# EAGLE design teste3 (EAGLE 9.6.2)
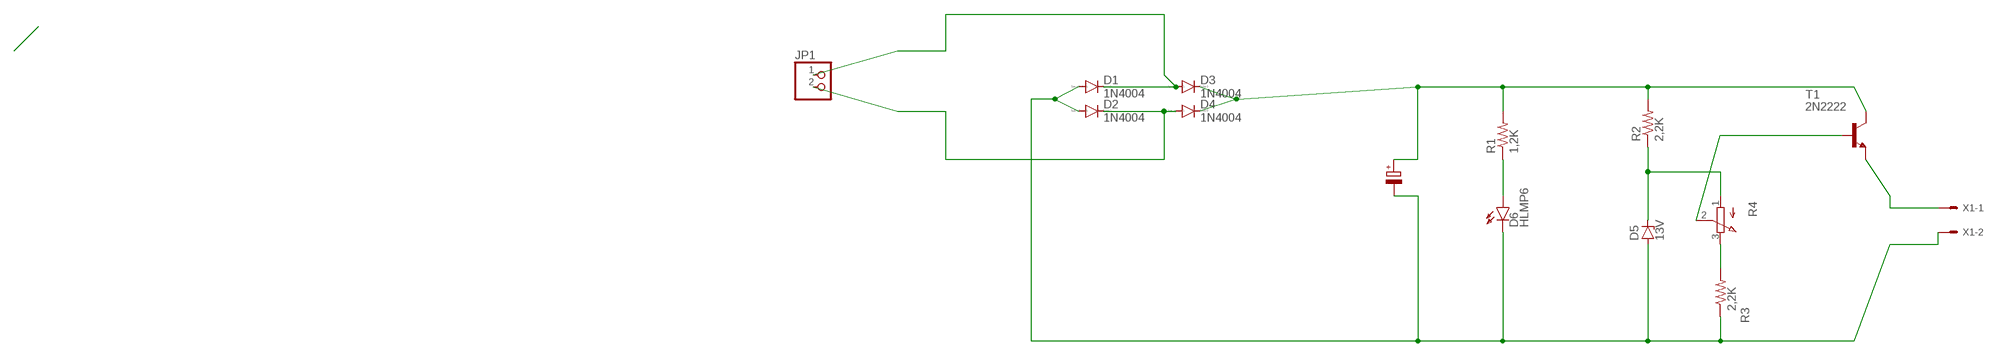
[diagram p0: schematic, sheet 1]

## Parts
D1  1N4004  [DO41-10]
D2  1N4004  [DO41-10]
D3  1N4004  [DO41-10]
D4  1N4004  [DO41-10]
D5  13V  BZD23  [SOD81]
D6  HLMP6  [HLMP6]
JP1  PINHD-1X2  [1X02]
R1  1,2K  R-US_0613/15  [P0613/15]
R2  2,2K  R-US_0613/15  [P0613/15]
R3  2,2K  R-US_0613/15  [P0613/15]
R4  3RP/1610N  [3RP/1610N]
T1  2N2222  [TO18]
X1  KK-156-2  [KK-156-2]

## Nets
N$2: D6.A R1.1
N$3: D1.A D2.A D5.A D6.K R3.1 X1.2
N$4: D2.C D4.A JP1.2
N$5: D3.C D4.C R1.2 R2.2 T1.3(C)
N$6: D5.C R2.1 R4.1(A)
N$7: R3.2 R4.3(E)
N$8: R4.2(S) T1.2(B)
N$9: T1.1(E) X1.1
N$11: D1.C D3.A JP1.1

## Library data of the parts
D1-D4 = diode:1N4004: DIODE general purpose rectifier, 1 A
D5 = diode:BZD23: Z DIODE
D6 = display-hp:HLMP6: LED 2mm horizontal; MF: AGILENT TECHNOLOGIES; MPN: HLMP-6500; OC_FARNELL: 1652490; OC_NEWARK: 40K0088
JP1 = pinhead:PINHD-1X2: PIN HEADER
R1-R3 = rcl:R-US_: RESISTOR, American symbol; SPICEPREFIX: R
R4 = pot:3RP/1610N: 16mm Potentiometer one level Source: http://www.alphapotentiometers.net/html/16mm_pot_2.html
T1 = transistor:2N2222: NPN TRANSISTOR
X1 = con-molex:KK-156-2: KK 156 HEADER Source: http://www.molex.com/pdm_docs/sd/026604100_sd.pdf; MF: MOLEX; OC_FARNELL: unknown; OC_NEWARK: unknown

## Board
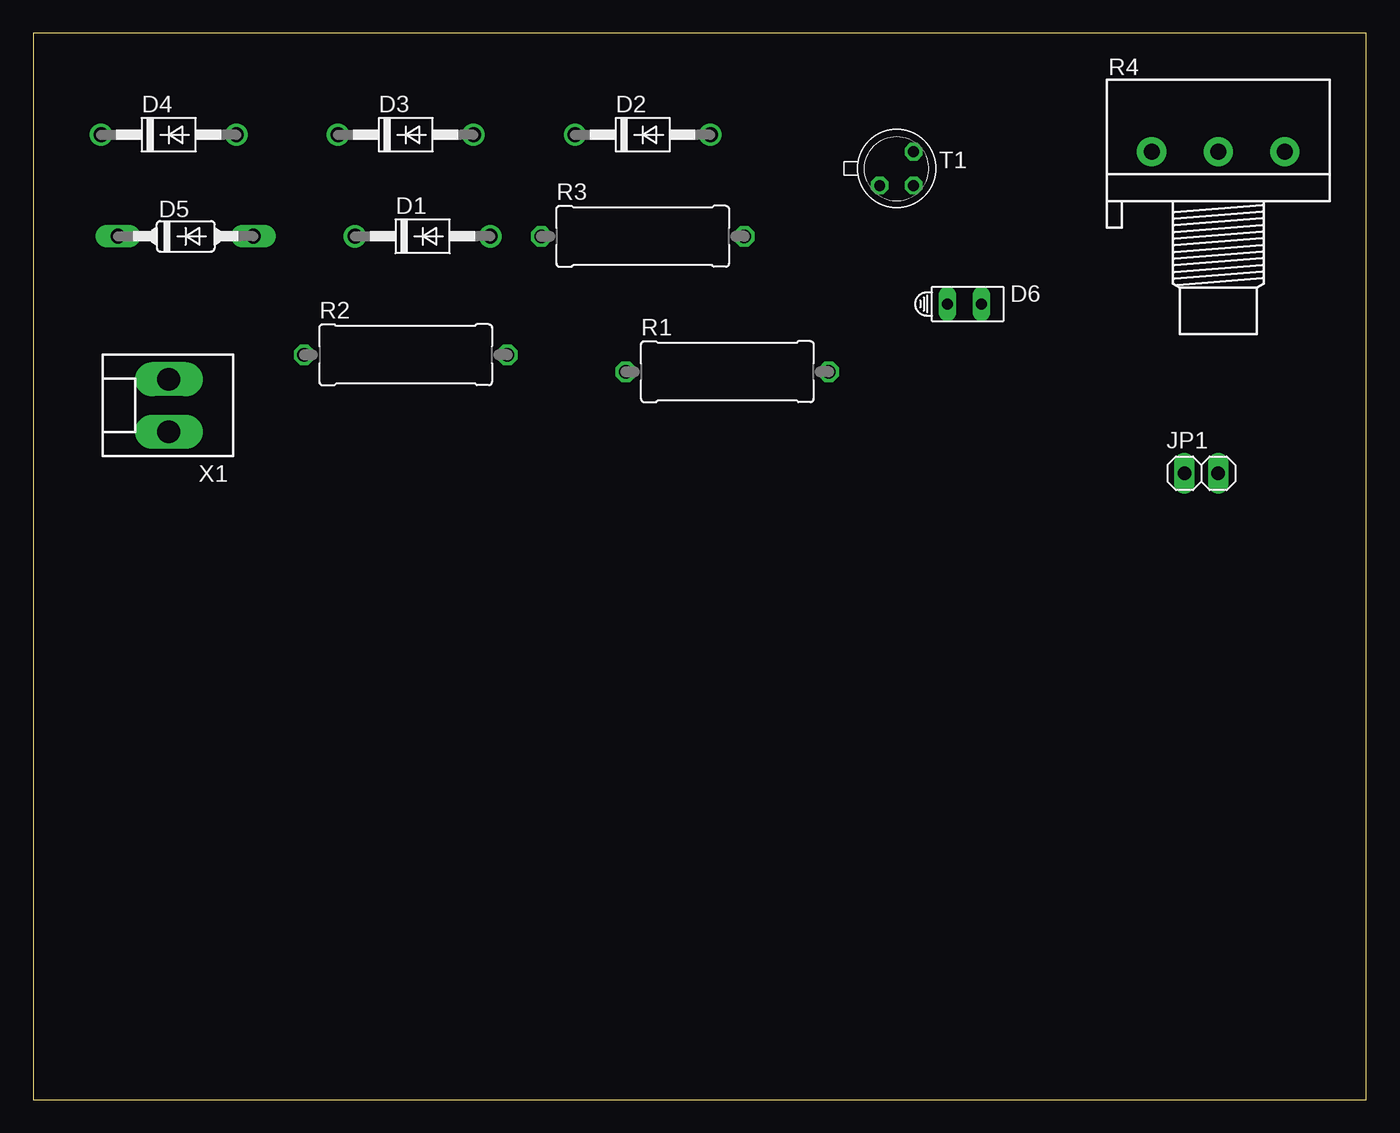
[diagram p1: board, top side]
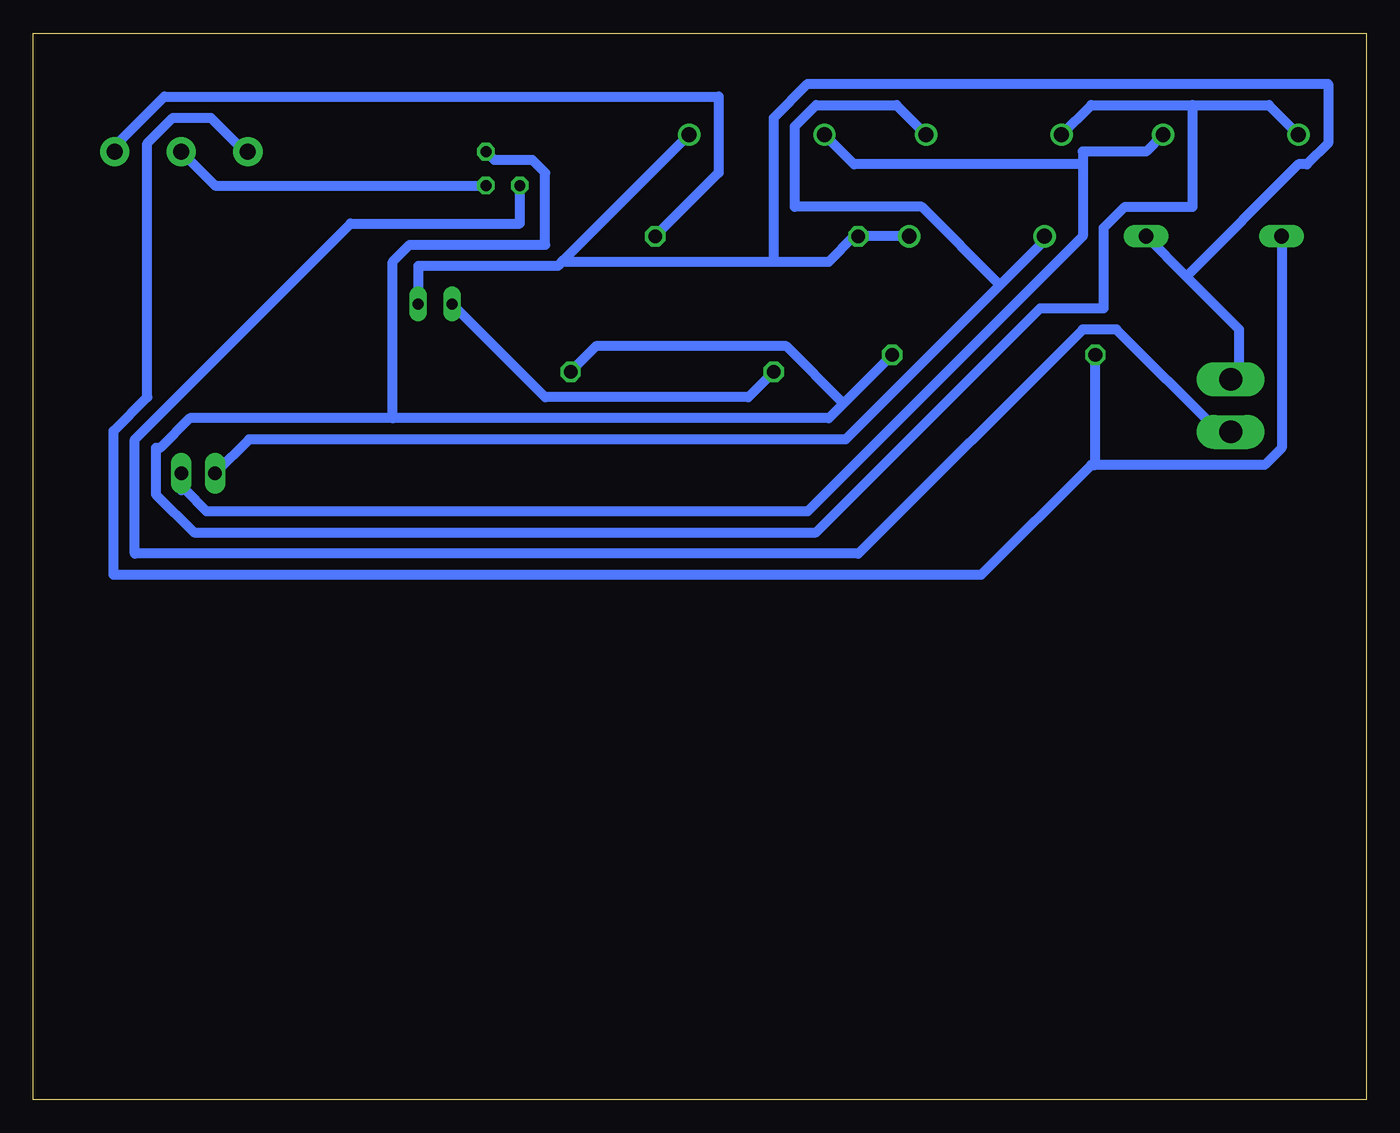
[diagram p2: board, bottom side, seen from below]

Size 100 x 80 mm. Coordinates in mm from the lower left corner, seen from the top.
Outline: 0,0 100,0 100,80 0,80 0,0
Copper layers (1*16): Top 0.035mm / dielectric 1.5mm / Bottom 0.035mm
Design rules "default *": minimum track width 30mil, minimum drill 0.35mm, track to track 30mil, track to pad 30mil, pad to pad 30mil, via to via 30mil, smd to smd 6mil, copper to edge 40mil, drill to drill 6mil, minimum pad ring 10mil, minimum via ring 8mil, stop-mask expansion 4mil, vias tented up to drill 0mil, thermal gap 10mil

### Footprints (pad centres in the part's own frame; a part is rotated, then mirrored left to right if it is on the bottom)
DO41-10 = drill 1.118: A 5.08,0; C -5.08,0
SOD81 = drill 1.118 long: A 5.08,0; C -5.08,0
HLMP6 = drill 0.813 long: A -1.27,0; K 1.27,0
1X02 = drill 1.016 long: 1 -1.27,0; 2 1.27,0
P0613/15 = drill 1.016 octagon: 1 -7.62,0; 2 7.62,0
3RP/1610N = drill 1.2 pad 2.184: 1 -5,0; 2 0,0; 3 5,0
TO18 = drill 0.813 octagon: 1 -1.27,-1.27; 2 1.27,-1.27; 3 1.27,1.27
KK-156-2 = drill 1.7 pad 2.184 long: 1 -1.98,0; 2 1.98,0

### Placement (x,y rotation side)
D1  29.21,64.77 0 top
D2  45.72,72.39 0 top
D3  27.94,72.39 0 top
D4  10.16,72.39 0 top
D5  11.43,64.77 0 top
D6  69.85,59.69 0 top
JP1  87.63,46.99 0 top
R1  52.07,54.61 0 top
R2  27.94,55.88 0 top
R3  45.72,64.77 0 top
R4  88.9,71.12 0 top
T1  64.77,69.85 0 top
X1  10.16,52.07 90 top

### Tracks (layer width: path | path; a pad name or v marks a point on that pad's centre or on a via)
N$2
  Bottom 0.762: D6.A 61.59,52.7 46.35,52.7 R1.1
N$3
  Bottom 0.762: 13.49,61.75 9.53,57.78 9.53,54.29 10.16,54.29 X1.2 | 13.49,61.75 D5.A | D1.A R3.1 38.42,64.77 40.32,62.87 44.45,62.87 | D6.K 71.12,62.55 60.64,62.55 60.17,63.02 | D2.A 60.17,63.02 | 44.45,62.87 60.01,62.87 60.17,63.02 | 13.49,61.75 5.08,70.17 4.45,70.17 2.86,71.75 2.86,76.2 41.91,76.2 44.45,73.66 44.45,62.87
N$4
  Bottom 0.762: JP1.2 88.9,45.72 88.58,45.72 87,44.13 41.91,44.13 21.27,64.77 21.27,70.17 | 21.27,70.17 21.27,71.12 16.51,71.12 D4.A | D2.C 38.42,70.17 21.27,70.17
N$5
  Bottom 0.762: D4.C 7.3,74.61 13.02,74.61 | 13.02,74.61 20.64,74.61 D3.C | T1.3 65.41,70.48 62.55,70.48 61.59,69.53 61.59,64.14 71.75,64.14 73.03,62.87 73.03,51.12 | 73.03,51.12 40.32,51.12 39.21,52.23 | R2.2 39.21,52.23 | R1.2 57.78,56.52 43.5,56.52 39.21,52.23 | 13.02,74.61 13.02,66.99 18.1,66.99 19.68,65.41 19.68,59.37 24.45,59.37 41.27,42.55 87.95,42.55 90.81,45.4 90.81,48.9 90.49,48.9 88.27,51.12 73.03,51.12
N$6
  Bottom 0.762: 20.32,47.62 R2.1 | 20.32,47.62 7.62,47.62 6.35,48.9 D5.C | R4.1 84.14,71.12 86.68,73.66 89.53,73.66 91.44,71.75 91.44,52.7 93.98,50.16 93.98,39.37 28.89,39.37 20.64,47.62 20.32,47.62
N$7
  Bottom 0.762: R3.2 48.58,69.53 48.58,75.25 90.17,75.25 93.66,71.75 93.66,71.12 R4.3
N$8
  Bottom 0.762: T1.2 86.36,68.58 R4.2
N$9
  Bottom 0.762: T1.1 63.5,65.72 76.2,65.72 92.39,49.53 92.39,40.96 38.1,40.96 21.27,57.78 18.73,57.78 11.11,50.16 10.16,50.16 X1.1
N$11
  Bottom 0.762: JP1.1 83.82,49.53 39.05,49.53 27.46,61.12 | 27.46,61.12 24.13,64.45 D1.C | D3.A 35.24,74.61 41.27,74.61 42.86,73.03 42.86,66.99 33.34,66.99 27.46,61.12